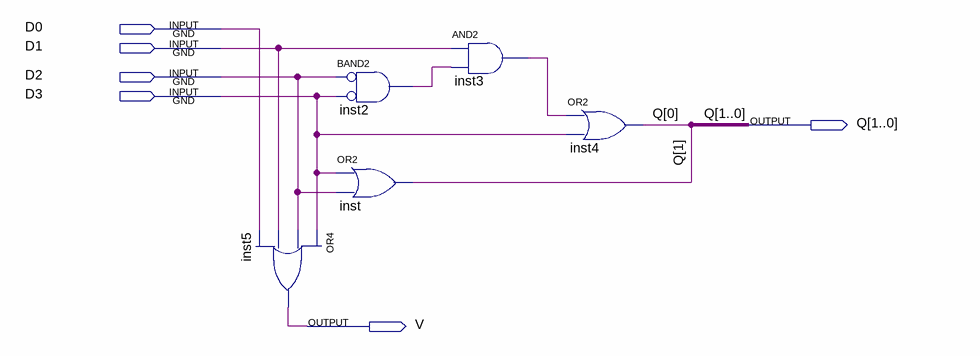
[diagram p0: schematic sheet]
// Quartus schematic cd4_2.bdf as structural Verilog: 5 symbols, 6 pins
module cd4_2 (
  input  D0,
  input  D1,
  input  D2,
  input  D3,
  output [1:0] Q,
  output V
);

  wire inst2_out, inst3_out;

  or inst5 (V, D3, D2, D1, D0);
  and inst2 (inst2_out, ~D2, ~D3);  // BAND2
  or inst (Q[1], D3, D2);
  and inst3 (inst3_out, D1, inst2_out);
  or inst4 (Q[0], inst3_out, D3);
endmodule
